# Altium schematic sheet 1st RMII.SchDoc
size 220 x 165 mm
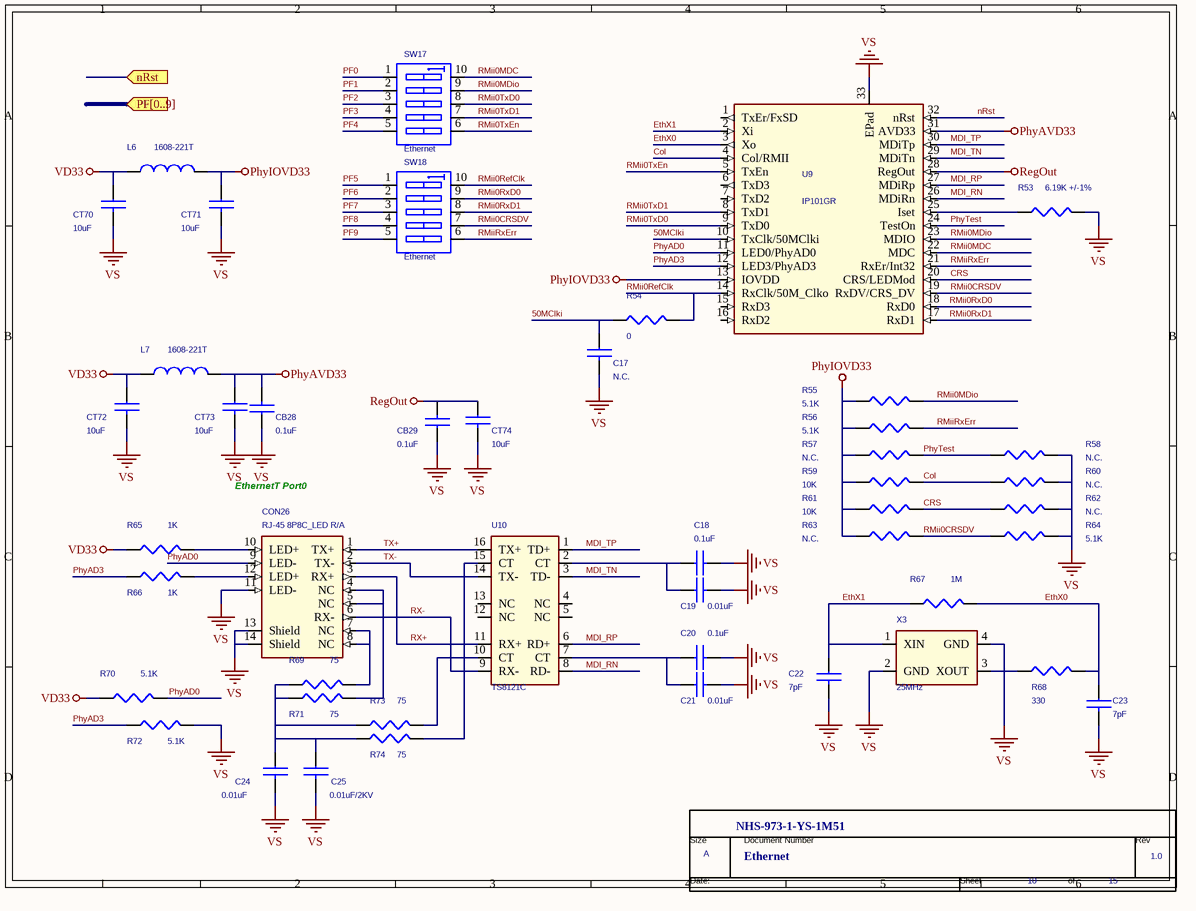
[diagram p0: 1st RMII.SchDoc]

## Parts
*  RevCode: 1.0  Page Size: A  Page Number: 10  Page Count: 15  Doc: Ethernet  OrgName: NHS-973-1-YS-1M51  (hidden comment: TitleBlock0N)  (graphical)
C17  N.C.  [C0603]
C18  0.1uF  [C0603]
C19  0.01uF  [C0603]
C20  0.1uF  [C0603]
C21  0.01uF  [C0603]
C22  7pF  [C0603]
C23  7pF  [C0603]
C24  0.01uF  [C0603]
C25  0.01uF/2KV  [CK05]
CB28  0.1uF  [C0603]
CB29  0.1uF  [C0603]
CON26  RJ-45 8P8C_LED R/A  [RJ45\8P\JA\LED]
CT70  10uF  [C0603]
CT71  10uF  [C0603]
CT72  10uF  [C0603]
CT73  10uF  [C0603]
CT74  10uF  [C0603]
L6  1608-221T  [L0603]
L7  1608-221T  [L0603]
R53  6.19K +/-1%  [R0603]
R54  0  [R0603]
R55  5.1K  [R0603]
R56  5.1K  [R0603]
R57  N.C.  [R0603]
R58  N.C.  [R0603]
R59  10K  [R0603]
R60  N.C.  [R0603]
R61  10K  [R0603]
R62  N.C.  [R0603]
R63  N.C.  [R0603]
R64  5.1K  [R0603]
R65  1K  [R0603]
R66  1K  [R0603]
R67  1M  [R0603]
R68  330  [R0603]
R69  75  [R0603]
R70  5.1K  [R0603]
R71  75  [R0603]
R72  5.1K  [R0603]
R73  75  [R0603]
R74  75  [R0603]
SW17  Ethernet  [DIPSWx5_2.54mm]
SW18  Ethernet  [DIPSWx5_2.54mm]
U9  IP101GR  [QFN32]
U10  TS8121C  [ST6200T]
X3  25MHz  [SOT-143]

## Ports
nRst (in), PF[0..9] (in)

## Nets
PhyAVD33: CB28.2 CT73.1 L7.2 U9.31(AVD33)
PhyIOVD33: CT71.1 L6.2 R55.2 R56.2 R57.2 R59.2 R61.2 R63.2 U9.13(IOVDD)
RegOut: CB29.2 CT74.1 U9.28(RegOut)
VD33: CT70.1 CT72.1 L6.1 L7.1 R65.1 R70.1
VS: C17.2 C18.2 C19.2 C20.2 C21.2 C22.2 C23.2 C24.2 C25.2 CB28.1 CB29.1 CON26.11(LED-) CON26.13(Shield) CON26.14(Shield) CT70.2 CT71.2 CT72.2 CT73.2 CT74.2 R53.1 R58.1 R60.1 R62.1 R64.1 R72.2 U9.33(EPad) X3.2(GND) X3.4(GND)
50MClki: C17.1 R54.2 U9.10(TxClk/50MClki)
Col: R59.1 R60.2 U9.4(Col/RMII)
CRS: R61.1 R62.2 U9.20(CRS/LEDMod)
EthX0: C23.1 R67.1 R68.2 U9.3(Xo)
EthX1: C22.1 R67.2 U9.2(Xi) X3.1(XIN)
MDI_RN: U9.26(MDiRn) U10.8(RD-)
MDI_RP: U9.27(MDiRp) U10.6(RD+)
MDI_TN: U9.29(MDiTn) U10.3(TD-)
MDI_TP: U9.30(MDiTp) U10.1(TD+)
nRst: U9.32(nRst)
PF0: SW17.1(A1)
PF1: SW17.2(A2)
PF2: SW17.3(A3)
PF3: SW17.4(A4)
PF4: SW17.5(A5)
PF5: SW18.1(A1)
PF6: SW18.2(A2)
PF7: SW18.3(A3)
PF8: SW18.4(A4)
PF9: SW18.5(A5)
PhyAD0: CON26.9(LED-) R70.2 U9.11(LED0/PhyAD0)
PhyAD3: R66.1 R72.1 U9.12(LED3/PhyAD3)
PhyTest: R57.1 R58.2 U9.24(TestOn)
RMii0CRSDV: R63.1 R64.2 SW18.7(B4) U9.19(RxDV/CRS_DV)
RMii0MDC: SW17.10(B1) U9.22(MDC)
RMii0MDio: R55.1 SW17.9(B2) U9.23(MDIO)
RMii0RefClk: R54.1 SW18.10(B1) U9.14(RxClk/50M_Clko)
RMii0RxD0: SW18.9(B2) U9.18(RxD0)
RMii0RxD1: SW18.8(B3) U9.17(RxD1)
RMii0TxD0: SW17.8(B3) U9.9(TxD0)
RMii0TxD1: SW17.7(B4) U9.8(TxD1)
RMii0TxEn: SW17.6(B5) U9.5(TxEn)
RMiiRxErr: R56.1 SW18.6(B5) U9.21(RxEr/Int32)
RX+: CON26.3(RX+) U10.11(RX+)
RX-: CON26.6(RX-) U10.9(RX-)
TX+: CON26.1(TX+) U10.16(TX+)
TX-: CON26.2(TX-) U10.14(TX-)
NetC18_1: C18.1 C19.1 U10.2(CT)
NetC20_1: C20.1 C21.1 U10.7(CT)
NetC24_1: C24.1 C25.1 R69.1 R71.1 R73.1 R74.1
NetCON26_4: CON26.4(NC) CON26.5(NC) R71.2
NetCON26_7: CON26.7(NC) CON26.8(NC) R69.2
NetCON26_10: CON26.10(LED+) R65.2
NetCON26_12: CON26.12(LED+) R66.2
NetR53_2: R53.2 U9.25(Iset)
NetR68_1: R68.1 X3.3(XOUT)
NetR73_2: R73.2 U10.10(CT)
NetR74_2: R74.2 U10.15(CT)

Not connected (* = marked no-connect by the designer): U9 1(TxEr/FxSD) 6(TxD3) 7(TxD2) 15(RxD3) 16(RxD2); U10 4(NC) 5(NC) 12(NC) 13(NC)

## Notes on the sheet
- EthernetT Port0
- (in symbol TitleBlock0N) Size; Document Number; Rev; Date:; Sheet; of

## Library data of the parts
C17-C25 CB28 CB29 CT70-CT74 = CAP NP
CON26 = RJ45_SHLD_0
L6 L7 = INDUCTOR
R53-R74 = R
SW17 SW18 = SW DIP-5_0
U9 = IP101GA_0
U10 = PE-68515_1
X3 = Crystal_SMD_2: Vendor: Aurum
* = TitleBlock0N: Page Create Date: April 25, 1995